# Altium schematic sheet Inverter.SchDoc
size A4; SheetNumber: 1; SheetTotal: 4
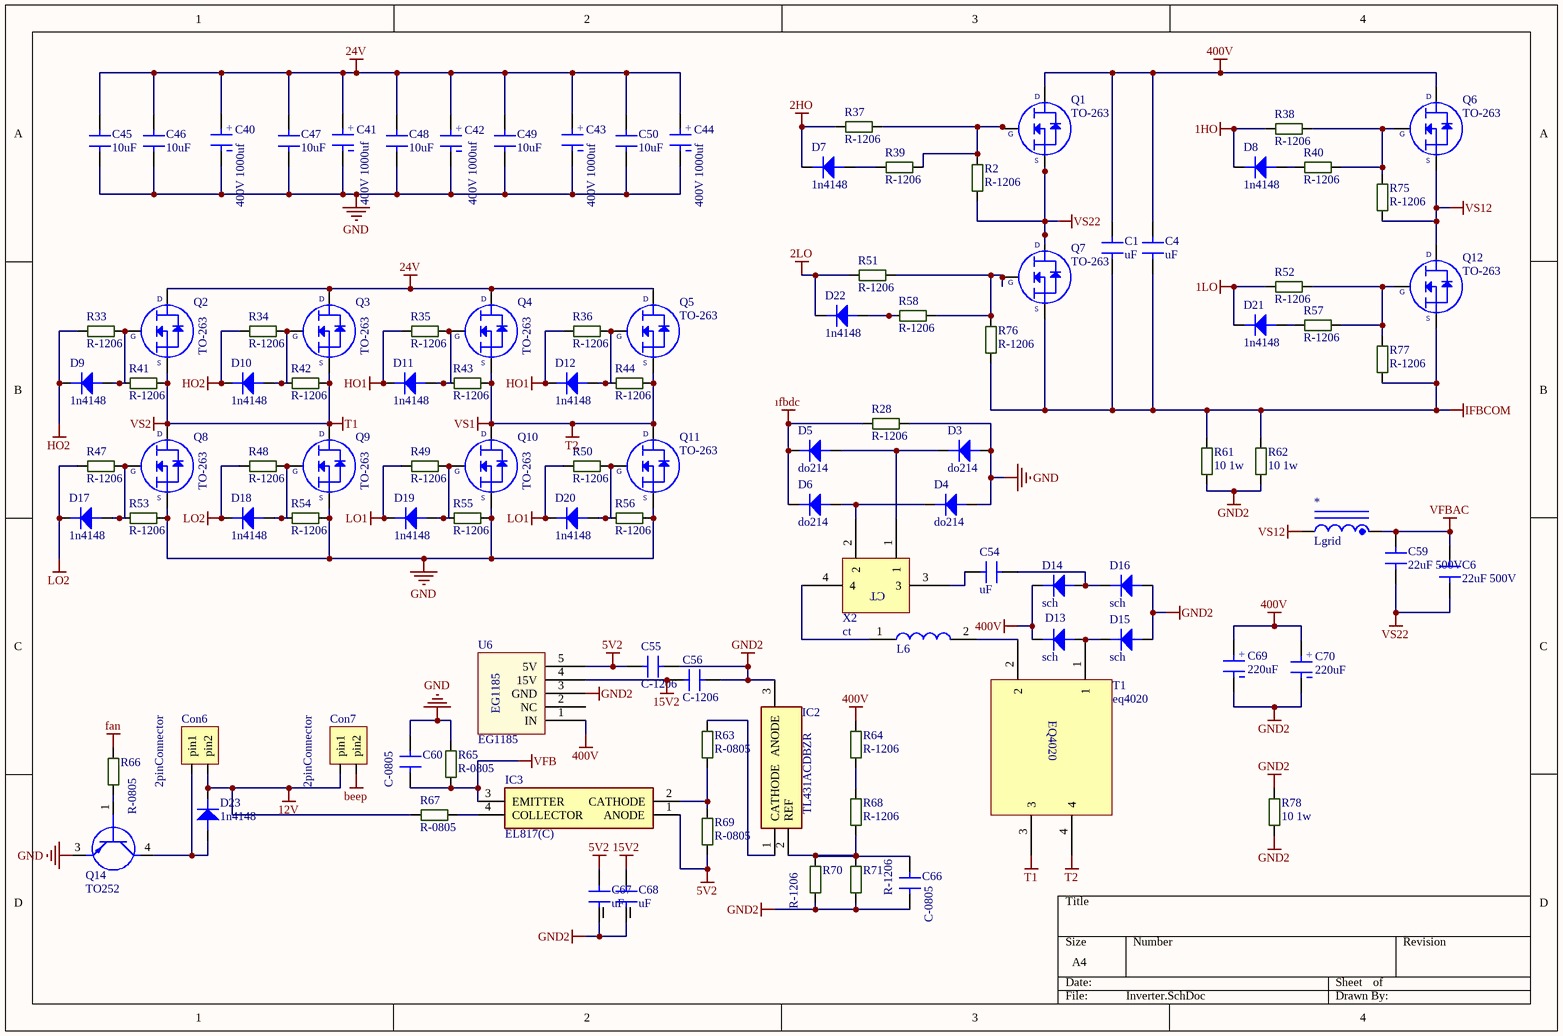
[diagram p0: Inverter.SchDoc]

## Parts
*  Lgrid  [Lgrid]
C1  uF  [680nF bulk]
C4  uF  [680nF bulk]
C6  22uF 500V  [CAP.POL 22UF 500VDC - duplicate]
C40  400V 1000uf  [CAP_EEETC1C331V]
C41  400V 1000uf  [CAP_EEETC1C331V]
C42  400V 1000uf  [CAP_EEETC1C331V]
C43  400V 1000uf  [CAP_EEETC1C331V]
C44  400V 1000uf  [CAP_EEETC1C331V]
C45  10uF  [C-2220R]
C46  10uF  [C-2220R]
C47  10uF  [C-2220R]
C48  10uF  [C-2220R]
C49  10uF  [C-2220R]
C50  10uF  [C-2220R]
C54  uF  [680nF bulk]
C55  C-1206  [C-1206W]
C56  C-1206  [C-1206W]
C59  22uF 500V  [CAP.POL 22UF 500VDC - duplicate]
C60  C-0805  [C-0805W]
C66  C-0805  [C-0805W]
C67  uF  [CapSmdElc]
C68  uF  [CapSmdElc]
C69  220uF  [Koshin]
C70  220uF  [Koshin]
Con6  2pinConnector  [2pinCon]
Con7  2pinConnector  [2pinCon]
D3  do214  [DO-214AC]
D4  do214  [DO-214AC]
D5  do214  [DO-214AC]
D6  do214  [DO-214AC]
D7  1n4148  [SOD123]
D8  1n4148  [SOD123]
D9  1n4148  [SOD123]
D10  1n4148  [SOD123]
D11  1n4148  [SOD123]
D12  1n4148  [SOD123]
D13  sch  [DPAK_TO263 - sch]
D14  sch  [DPAK_TO263 - sch]
D15  sch  [DPAK_TO263 - sch]
D16  sch  [DPAK_TO263 - sch]
D17  1n4148  [SOD123]
D18  1n4148  [SOD123]
D19  1n4148  [SOD123]
D20  1n4148  [SOD123]
D21  1n4148  [SOD123]
D22  1n4148  [SOD123]
D23  1n4148  [SOD123]
IC2  TL431ACDBZR  [SOT95P237X112-3N]
IC3  EL817(C)  [DIP762W60P254L458H480Q4N]
L6  inducter_SMPI06050  [inductor]  (value not drawn)
Q1  TO-263  [DPAK_TO263]
Q2  TO-263  [DPAK_TO263]
Q3  TO-263  [DPAK_TO263]
Q4  TO-263  [DPAK_TO263]
Q5  TO-263  [DPAK_TO263]
Q6  TO-263  [DPAK_TO263]
Q7  TO-263  [DPAK_TO263]
Q8  TO-263  [DPAK_TO263]
Q9  TO-263  [DPAK_TO263]
Q10  TO-263  [DPAK_TO263]
Q11  TO-263  [DPAK_TO263]
Q12  TO-263  [DPAK_TO263]
Q14  TO252  [D-PAK_TO252AA]
R2  R-1206  [R-1206W]
R28  R-1206  [R-1206W]
R33  R-1206  [R-1206W]
R34  R-1206  [R-1206W]
R35  R-1206  [R-1206W]
R36  R-1206  [R-1206W]
R37  R-1206  [R-1206W]
R38  R-1206  [R-1206W]
R39  R-1206  [R-1206W]
R40  R-1206  [R-1206W]
R41  R-1206  [R-1206W]
R42  R-1206  [R-1206W]
R43  R-1206  [R-1206W]
R44  R-1206  [R-1206W]
R47  R-1206  [R-1206W]
R48  R-1206  [R-1206W]
R49  R-1206  [R-1206W]
R50  R-1206  [R-1206W]
R51  R-1206  [R-1206W]
R52  R-1206  [R-1206W]
R53  R-1206  [R-1206W]
R54  R-1206  [R-1206W]
R55  R-1206  [R-1206W]
R56  R-1206  [R-1206W]
R57  R-1206  [R-1206W]
R58  R-1206  [R-1206W]
R61  10 1w  [R-2512W]
R62  10 1w  [R-2512W]
R63  R-0805  [R-0805W]
R64  R-1206  [R-1206W]
R65  R-0805  [R-0805W]
R66  R-0805  [R-0805W]
R67  R-0805  [R-0805W]
R68  R-1206  [R-1206W]
R69  R-0805  [R-0805W]
R70  R-1206  [R-1206W]
R71  R-1206  [R-1206W]
R75  R-1206  [R-1206W]
R76  R-1206  [R-1206W]
R77  R-1206  [R-1206W]
R78  10 1w  [R-2512W]
T1  eq4020  [eq4020]
U6  EG1185  [EG1185]
X2  ct  [ct]

## Nets
1HO: D8.k R38.1
1LO: D21.k R52.1
2HO: D7.k R37.1
2LO: D22.k R51.1
5V2: C55.1 C67.1 IC3.1(ANODE) R69.1 U6.5(5V)
12V: Con6.2(pin2) Con7.1(pin1) D23.k R67.1
15V2: C56.1 C68.1 U6.4(15V)
24V: C40.1 C41.1 C42.1 C43.1 C44.1 C45.1 C46.1 C47.1 C48.1 C49.1 C50.1 Q2.3 Q3.3 Q4.3 Q5.3
400V: C1.2 C4.2 C69.2 C70.2 D13.1 D14.1 Q1.3 Q6.3 R64.2 U6.1(IN)
beep: Con7.2(pin2)
fan: R66.1
GND: C40.2 C41.2 C42.2 C43.2 C44.2 C45.2 C46.2 C47.2 C48.2 C49.2 C50.2 C60.2 D3.a D4.a Q8.2 Q9.2 Q10.2 Q11.2 Q14.3(E) R28.2 R53.2 R54.2 R55.2 R56.2 R65.2
GND2: C55.2 C56.2 C66.1 C67.2 C68.2 C69.1 C70.1 D15.2 D16.2 IC2.3(ANODE) R61.1 R62.1 R70.1 R71.1 R78.1 R78.2 U6.3(GND)
HO1: D11.k D12.k R35.1 R36.1
HO2: D9.k D10.k R33.1 R34.1
IFBCOM: C1.1 C4.1 Q7.2 Q12.2 R61.2 R62.2 R76.1 R77.2
LO1: D19.k D20.k R49.1 R50.1
LO2: D17.k D18.k R47.1 R48.1
T1: Q2.2 Q3.2 Q8.3 Q9.3 R41.2 R42.2 T1.3  [also labelled VS2]
T2: Q4.2 Q5.2 Q10.3 Q11.3 R43.2 R44.2 T1.4  [also labelled VS1]
VFB: C60.1 IC3.3(EMITTER) R65.1
VFBAC: *.1 C6.2 C59.2
VS12: *.2 Q6.2 Q12.3 R75.2
VS22: C6.1 C59.1 Q1.2 Q7.3 R2.1
ıfbdc: D5.k D6.k R28.1
NetC54_1: C54.1 X2.3
NetC54_2: C54.2 D14.2 D16.1
NetC66_2: C66.2 IC2.2(REF) R68.1 R70.2 R71.2
NetCon6_1: Con6.1(pin1) D23.a Q14.4(C)
NetD3_k: D3.k D5.a X2.1
NetD4_k: D4.k D6.a X2.2
NetD7_a: D7.a R39.1
NetD8_a: D8.a R40.1
NetD9_a: D9.a Q2.1 R33.2 R41.1
NetD10_a: D10.a Q3.1 R34.2 R42.1
NetD11_a: D11.a Q4.1 R35.2 R43.1
NetD12_a: D12.a Q5.1 R36.2 R44.1
NetD13_2: D13.2 D15.1 T1.1
NetD17_a: D17.a Q8.1 R47.2 R53.1
NetD18_a: D18.a Q9.1 R48.2 R54.1
NetD19_a: D19.a Q10.1 R49.2 R55.1
NetD20_a: D20.a Q11.1 R50.2 R56.1
NetD21_a: D21.a R57.1
NetD22_a: D22.a R58.1
NetIC2_1: IC2.1(CATHODE) R63.1
NetIC3_2: IC3.2(CATHODE) R63.2 R69.2
NetIC3_4: IC3.4(COLLECTOR) R67.2
NetL6_1: L6.1 X2.4
NetL6_2: L6.2 T1.2
NetQ1_1: Q1.1 R2.2 R37.2 R39.2
NetQ6_1: Q6.1 R38.2 R40.2 R75.1
NetQ7_1: Q7.1 R51.2 R58.2 R76.2
NetQ12_1: Q12.1 R52.2 R57.2 R77.1
NetQ14_1: Q14.1(B) R66.2
NetR64_1: R64.1 R68.2

Not connected (* = marked no-connect by the designer): U6 2(NC)

## Notes on the sheet
- (in symbol Aluminum Electrolytic Capacitors) +
- (in symbol CAP.EL.220uF 500V) +
- (in symbol ct) CT
- (in symbol eq4020) EQ4020
- (in symbol TO-263_1) D; G; S

## Library data of the parts
C1 C4 C54 = 680
C6 C59 = CAP.POL 22UF 500VDC: ComponentLink1Description: https://www.ozdisan.com/pasif-komponentler/kondansatorler/film-kondansatorler/C3D2H226JB00C00; ComponentLink1URL: https://www.ozdisan.com/pasif-komponentler/kondansatorler/film-kondansatorler/C3D2H226JB00C00
C40-C44 = Aluminum Electrolytic Capacitors: Manufacturer: Nichicon; Manufacturer Part Number: LKS1J472MESZ; Capacitance: 4.7mF; Voltage Rating: 63V; Tolerance: 20%; Ripple Current: 3A; Life (Hours): 1000Hour; Supplier 1: Mouser; RoHS: Yes; Mount: Through Hole; Case/Package: Radial; Min Operating Temperature: -40°C; Max Operating Temperature: 85°C; Package Quantity: 250; Packaging: Bulk; Voltage Rating (DC): 63V; Termination: Snap in; Diameter: 22mm; Length: 45mm; Lead Pitch: 0.394inch; Height - Seated (Max): 1.772inch; Supplier Part Number 1: 647-LKS1J472MESZ; ComponentLink2Description: https://www.ozdisan.com/pasif-komponentler/kondansatorler/aluminyum-kondansatorler/PKL5-063V472MM450; ComponentLink2URL: https://www.ozdisan.com/pasif-komponentler/kondansatorler/aluminyum-kondansatorler/PKL5-063V472MM450
C45-C50 = Cap2220: 2220; Özdisan Part Number: CL31B475KBHNNNE; Manufacturer: SAMSUNG; Link: https://www.ozdisan.com/pasif-komponentler/kondansatorler/smd-kondansatorler-mlcc/CL31B475KBHNNNE; Price: 0,10407
C67 C68 = CAPSMDELC
C69 C70 = CAP.EL.220uF 500V: ComponentLink1Description: https://www.ozdisan.com/pasif-komponentler/kondansatorler/aluminyum-kondansatorler/K055002210PM0E040; ComponentLink1URL: https://www.ozdisan.com/pasif-komponentler/kondansatorler/aluminyum-kondansatorler/K055002210PM0E040
D3-D6 = do214: DIODE FAST SWITCHING Single 150mA 75V SMT SOD323
D7-D12 D17-D23 = 1N4148W-E3-18: Diode Small Signal Switching 100V 0.15A 2-Pin SOD-123 T/R; Manufacturer: Vishay; Recovery Time: 4ns; Max Power Dissipation: 350mW; Forward Current: 150mA; Max Surge Current: 2A; Forward Voltage: 1.2V; Max Reverse Leakage Current: 5uA; Element Configuration: Single; Max Reverse Voltage (DC): 75V; Peak Reverse Current: 100uA; Supplier 1: Allied Electronics; Manufacturer Part Number: 1N4148W-E3-18; RoHS: Yes; Stock 1: 6838; Pricing 1: 1 = 0.03900, 25 = 0.03800, 100 = 0.03600, 250 = 0.03400, 500 = 0.03200, 1000 = 0.03100, 2500 = 0.02900 (USD); Mount: Surface Mount; Number of Pins: 2; Weight: 0.000363oz; Contact Plating: Tin; Min Operating Temperature: -55°C; Max Operating Temperature: 150°C; Packaging: Tape and Reel; Package Quantity: 10000; Average Rectified Current: 150mA; Reverse Recovery Time: 4ns; Power Dissipation: 350mW; Max Repetitive Reverse Voltage (Vrrm): 100V; Peak Non-Repetitive Surge Current: 2A; Length: 2.85mm; Height: 1.25mm; Width: 1.7mm; Radiation Hardening: No; Lead Free: Lead Free; ComponentLink1URL: https://datasheet.ciiva.com/29885/1n4148w-29885941.pdf?src-supplier=Avnet; ComponentLink1Description: https://datasheet.ciiva.com/29885/1n4148w-29885941.pdf?src-supplier=Avnet; ComponentLink2URL: https://datasheet.ciiva.com/29593/1n4148w-29593113.pdf?src-supplier=Digi-Key; ComponentLink2Description: https://datasheet.ciiva.com/29593/1n4148w-29593113.pdf?src-supplier=Digi-Key; ComponentLink3URL: https://datasheet.ciiva.com/29593/1n4148w-29593111.pdf?src-supplier=Digi-Key; ComponentLink3Description: https://datasheet.ciiva.com/29593/1n4148w-29593111.pdf?src-supplier=Digi-Key; ComponentLink4URL: https://datasheet.ciiva.com/29593/1n4148w-29593112.pdf?src-supplier=Digi-Key; ComponentLink4Description: https://datasheet.ciiva.com/29593/1n4148w-29593112.pdf?src-supplier=Digi-Key; Supplier Part Number 1: 70061597
D13-D16 = sch: DIODE FAST SWITCHING Single 150mA 75V SMT SOD323
IC2 = TL431ACDBZR: Integrated Circuit; Manufacturer_Name: Texas Instruments; Datasheet Link: https://datasheet.datasheetarchive.com/originals/distributors/SFDatasheet-6/sf-000131849.pdf; Manufacturer_Part_Number: TL431ACDBZR; Mouser Part Number: 595-TL431ACDBZR; Mouser Price/Stock: https://www.mouser.co.uk/ProductDetail/Texas-Instruments/TL431ACDBZR?qs=odmYgEirbwzMcBuFx%2Fo8hQ%3D%3D; Arrow Part Number: TL431ACDBZR; Arrow Price/Stock: https://www.arrow.com/en/products/tl431acdbzr/texas-instruments?region=nac
IC3 = EL817(C): Integrated Circuit; Manufacturer_Name: Everlight; Datasheet Link: https://componentsearchengine.com/Datasheets/1/EL817(C).pdf; Height: 4.8mm; Manufacturer_Part_Number: EL817(C); Mouser Part Number: 638-EL817C; Mouser Price/Stock: https://www.mouser.com/Search/Refine.aspx?Keyword=638-EL817C
Q1-Q12 = TO-263_1
R61 R62 R78 = R-2512